# EAGLE schematic untitled (EAGLE 7.5.0)
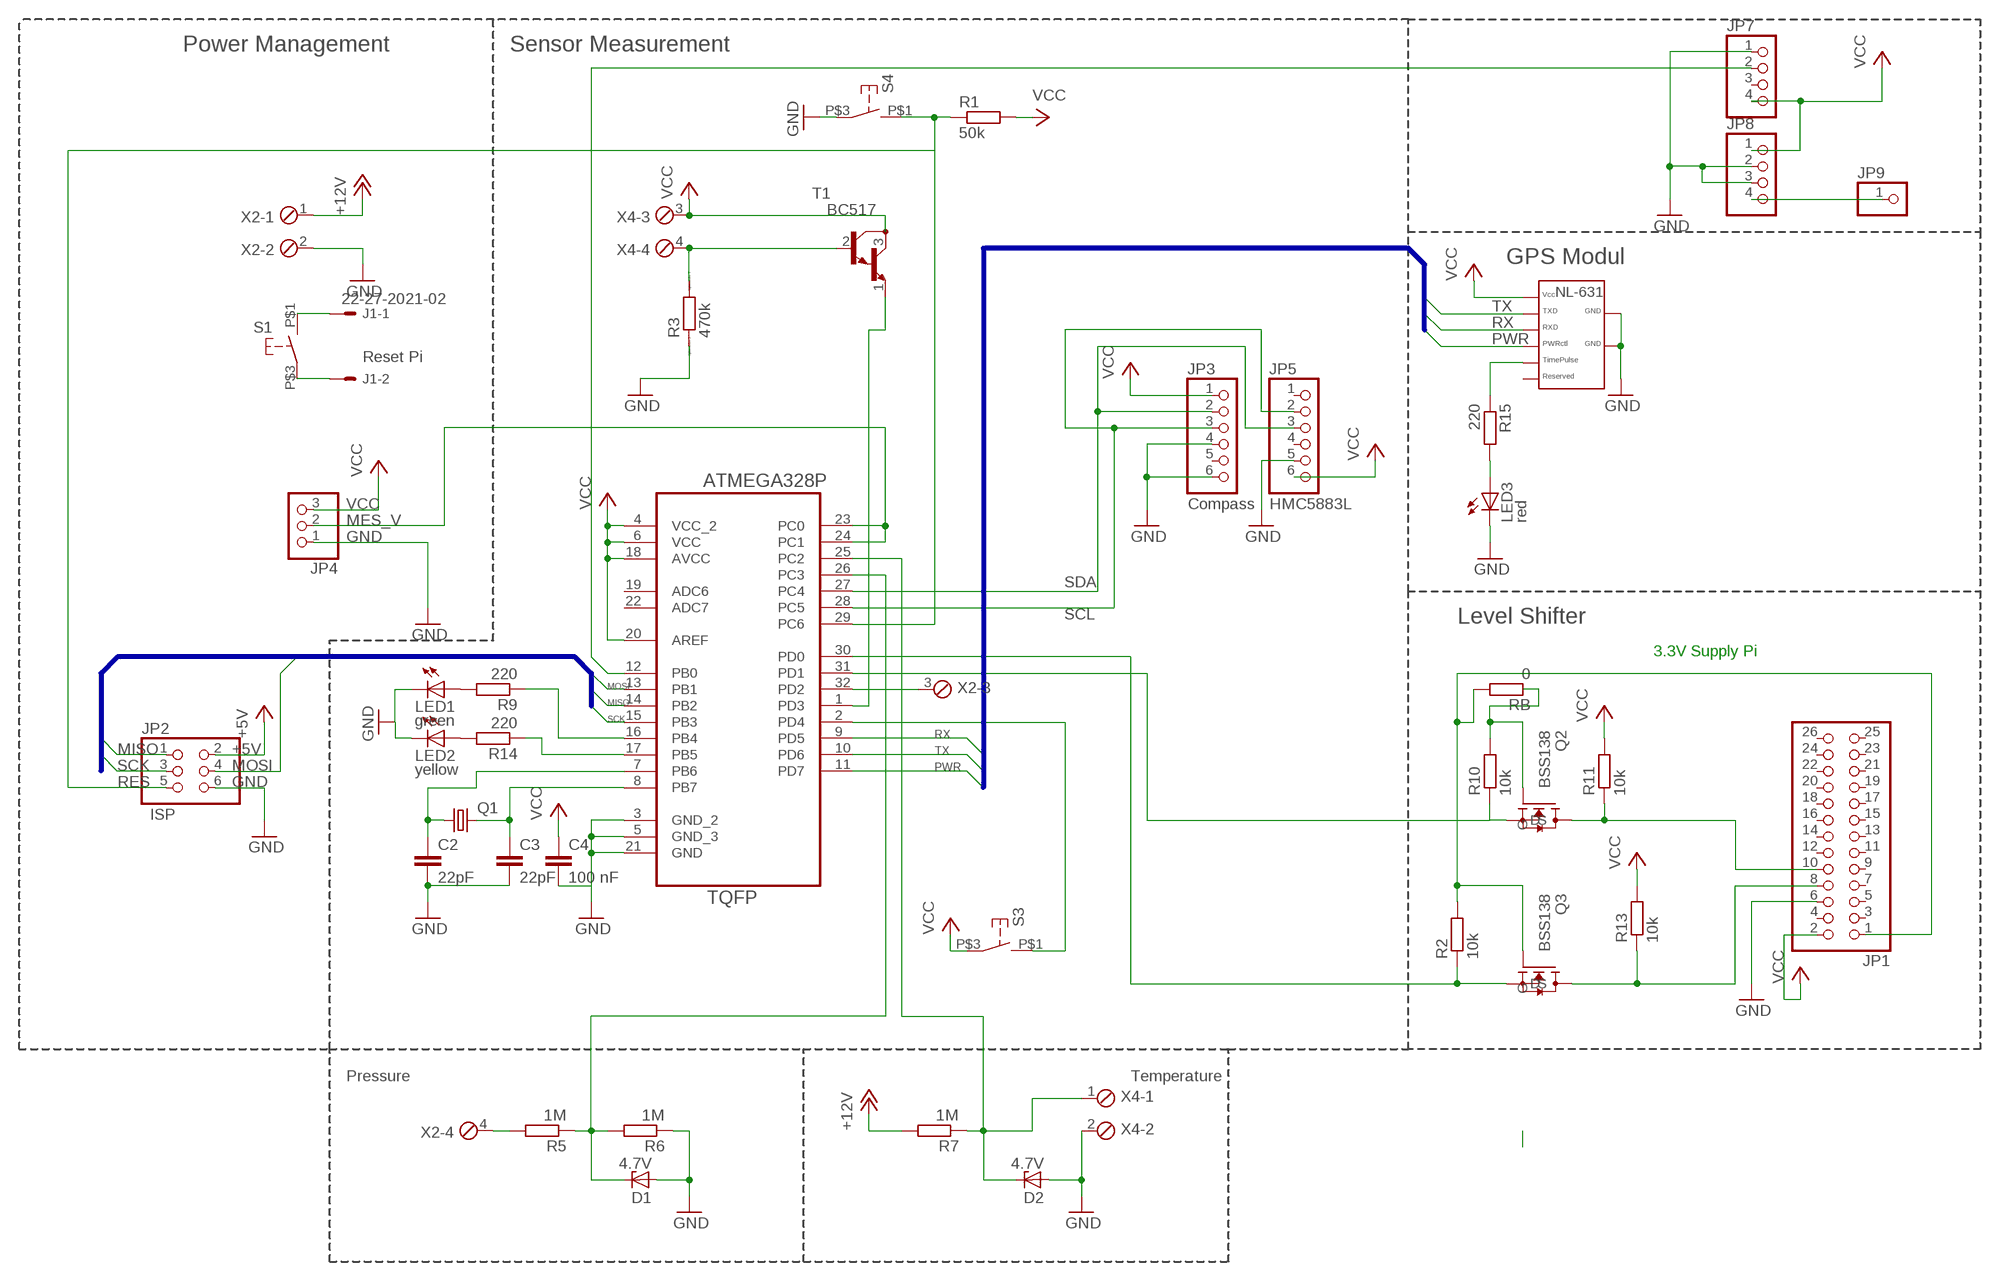
[diagram p0: schematic, sheet 1]

## Parts
C2  22pF  C-EUC1206  [C1206]
C3  22pF  C-EUC1206  [C1206]
C4  100 nF  C-EUC0603  [C0603]
D1  4.7V  ZENER-DIODESOT23  [SOT23]
D2  4.7V  ZENER-DIODESOT23  [SOT23]
IC1  ATMEGA328P-AU  [QFP80P900X900X120-32N]
J1  22-27-2021-02  [6410-02]
JP1  PINHD-2X13  [2X13]
JP2  PINHD-2X3  [2X03]
JP3  Compass  PINHD-1X6  [1X06]
JP4  PINHD-1X3  [1X03]
JP5  HMC5883L  PINHD-1X6  [1X06]
JP7  PINHD-1X4  [1X04]
JP8  PINHD-1X4  [1X04]
JP9  PINHD-1X1  [1X01]
LED1  green  LED3MM  [LED3MM]
LED2  yellow  LED3MM  [LED3MM]
LED3  red  LED3MM  [LED3MM]
Q1  CRYSTALHC49UP  [HC49UP]
Q2  BSS138  [BSS138]
Q3  BSS138  [BSS138]
R1  50k  R-EU_R1206  [R1206]
R2  10k  R-EU_R1206  [R1206]
R3  470k  RR1206  [R1206]
R5  1M  R-EU_R1206  [R1206]
R6  1M  R-EU_R1206  [R1206]
R7  1M  R-EU_R1206  [R1206]
R9  220  R-EU_R1206  [R1206]
R10  10k  R-EU_R1206  [R1206]
R11  10k  R-EU_R1206  [R1206]
R13  10k  R-EU_R1206  [R1206]
R14  220  R-EU_R1206  [R1206]
R15  220  R-EU_R1206  [R1206]
RB  0  R-EU_R1206  [R1206]
S1  SCHLIESSER_TASTSCHALTER  [NAMAE-JTP-1130]
S3  SCHLIESSER_TASTSCHALTER  [NAMAE-JTP-1130]
S4  SCHLIESSER_TASTSCHALTER  [NAMAE-JTP-1130]
T1  BC517  [TO92]
U$2  NAVILOK-NL-631ETTL  [NAVILOK-NL-631ETTL]
X2  MPT4  [4POL254]
X4  MPT4  [4POL254]

## Nets
+5V: JP2.2
+12V: R7.2 X2.1
GND: C2.2 C3.2 C4.2 D1.1(A) D2.1(A) IC1.3(GND_2) IC1.5(GND_3) IC1.21(GND) JP1.6 JP2.6 JP3.4 JP3.6 JP4.1 JP5.5 JP7.1 JP8.2 JP8.3 LED1.K(C) LED2.K(C) LED3.K(C) R3.1 R6.1 S4.P$3 U$2.P$7 U$2.P$8 X2.2 X4.2
MES_V: IC1.23(PC0) IC1.24(PC1) JP4.2
MISO: IC1.14(PB2) JP2.1
MOSI: IC1.13(PB1) JP2.4
N$1: R5.2 X2.4
N$3: C3.1 IC1.8(PB7) Q1.2
N$4: C2.1 IC1.7(PB6) Q1.1
N$5: IC1.28(PC5) JP3.3 JP5.2
N$6: R3.2 T1.2(B) X4.4
N$7: IC1.17(PB5) R14.1
N$8: JP8.4 JP9.1
N$9: IC1.32(PD2) X2.3
N$10: IC1.12(PB0) JP7.2
N$11: IC1.1(PD3) T1.1(E)
N$19: IC1.2(PD4) S3.P$1
N$20: LED1.A R9.2
N$21: IC1.27(PC4) JP3.2 JP5.3
N$23: JP1.1 Q3.G R2.2 RB.2
N$25: JP1.10 Q2.D R11.1
N$26: JP1.8 Q3.D R13.1
N$27: J1.1 S1.P$1
N$28: J1.2 S1.P$3
N$29: IC1.16(PB4) R9.1
N$30: LED2.A R14.2
N$32: R15.1 U$2.P$5
N$33: LED3.A R15.2
N$46: IC1.31(PD1) Q2.S R10.1
N$47: IC1.30(PD0) Q3.S R2.1
N$51: Q2.G R10.2 RB.1
PWR: IC1.11(PD7) U$2.P$4
RES: IC1.29(PC6) JP2.5 R1.1 S4.P$1
RESET: D1.3(C) IC1.26(PC3) R5.1 R6.2
RESET1: D2.3(C) IC1.25(PC2) R7.1 X4.1
RX: IC1.9(PD5) U$2.P$3
SCK: IC1.15(PB3) JP2.3
TX: IC1.10(PD6) U$2.P$2
VCC: C4.1 IC1.4(VCC_2) IC1.6(VCC) IC1.18(AVCC) IC1.20(AREF) JP1.2 JP3.1 JP4.3 JP5.6 JP7.4 JP8.1 R1.2 R11.2 R13.2 S3.P$3 T1.3(C) U$2.P$1 X4.3
Unconnected: IC1.19(ADC6) IC1.22(ADC7) JP1.3 JP1.4 JP1.5 JP1.7 JP1.9 JP1.11 JP1.12 JP1.13 JP1.14 JP1.15 JP1.16 JP1.17 JP1.18 JP1.19 JP1.20 JP1.21 JP1.22 JP1.23 JP1.24 JP1.25 JP1.26 JP3.5 JP5.1 JP5.4 JP7.3 U$2.P$6

## Buses
GPS:TX,RX,PWR
ISP:MOSI,MISO,SCK

## Notes on the sheet
- Power Management | Sensor Measurement
- GPS Modul
- Reset Pi
- SDA
- SCL | Level Shifter
- 3.3V Supply Pi
- ISP
- Pressure | Temperature

## Library data of the parts
C2-C4 = resistor:C-EU: CAPACITOR, European symbol
D1 D2 = diode:ZENER-DIODE: Z-Diode
IC1 = Ava:ATMEGA328P-AU; DESCRIPTION: 8-bit Microcontroller with In-System Programmable Flash; MPN: ATMEGA328P-AU; OC_FARNELL: 1715486; OC_NEWARK: 14R4631; PACKAGE: TQFP-32; SUPPLIER: Atmel
J1 = con-molex:22-?-02: CONNECTOR wire to board 2.54 mm (.1 inch) pitch header; OC_FARNELL: unknown; OC_NEWARK: unknown
JP1 = pinhead:PINHD-2X13: PIN HEADER
JP2 = pinhead:PINHD-2X3: PIN HEADER
JP3 JP5 = pinhead:PINHD-1X6: PIN HEADER
JP4 = pinhead:PINHD-1X3: PIN HEADER
JP7 JP8 = pinhead:PINHD-1X4: PIN HEADER
JP9 = pinhead:PINHD-1X1: PIN HEADER
LED1-LED3 = led:LED: LED OSRAM: - CHIPLED LG R971, LG N971, LY N971, LG Q971, LY Q971, LO R971, LY R971 LH N974, LH R974 LS Q976, LO Q976, LY Q976 LO Q996 - Hyper CHIPLED LW Q18S LB Q993, LB Q99A, LB R99A - SideLED LS A670, LO A670, LY A670, LG A670, LP A670 LB A673, LV A673, LT A673, LW A673 LH A674 LY A675 LS A676, LA A676, LO A676, LY A676, LW A676 LS A679, LY A679, LG A679 - Hyper Micro SIDELED® LS Y876, LA Y876, LO Y876, LY Y876 LT Y87S - SmartLED LW L88C, LW L88S LB L89C, LB L89S, LG L890 LS L89K, LO L89K, LY L89K LS L896, LA L896, LO L896, LY L896 - TOPLED LS T670, LO T670, LY T670, LG T670, LP T670 LSG T670, LSP T670, LSY T670, LOP T670, LYG T670 LG T671, LOG T671, LSG T671 LB T673, LV T673, LT T673, LW T673 LH T674 LS T676, LA T676, LO T676, LY T676, LB T676, LH T676, LSB T676, LW T676 LB T67C, LV T67C, LT T67C, LS T67K, LO T67K, LY T67K, LW E67C LS E67B, LA E67B, LO E67B, LY E67B, LB E67C, LV E67C, LT E67C LW T67C LS T679, LY T679, LG T679 LS T770, LO T770, LY T770, LG T770, LP T770 LB T773, LV T773, LT T773, LW T773 LH T774 LS E675, LA E675, LY E675, LS T675 LS T776, LA T776, LO T776, LY T776, LB T776 LHGB T686 LT T68C, LB T68C - Hyper Mini TOPLED® LB M676 - Mini TOPLED Santana® LG M470 LS M47K, LO M47K, LY M47K Source: http://www.osram.convergy.de LUXEON: - LUMILED® LXK2-PW12-R00, LXK2-PW12-S00, LXK2-PW14-U00, LXK2-PW14-V00 LXK2-PM12-R00, LXK2-PM12-S00, LXK2-PM14-U00 LXK2-PE12-Q00, LXK2-PE12-R00, LXK2-PE12-S00, LXK2-PE14-T00, LXK2-PE14-U00 LXK2-PB12-K00, LXK2-PB12-L00, LXK2-PB12-M00, LXK2-PB14-N00, LXK2-PB14-P00, LXK2-PB14-Q00 LXK2-PR12-L00, LXK2-PR12-M00, LXK2-PR14-Q00, LXK2-PR14-R00 LXK2-PD12-Q00, LXK2-PD12-R00, LXK2-PD12-S00 LXK2-PH12-R00, LXK2-PH12-S00 LXK2-PL12-P00, LXK2-PL12-Q00, LXK2-PL12-R00 Source: www.luxeon.com KINGBRIGHT: KA-3528ASYC Source: www.kingbright.com
Q1 = crystal:CRYSTAL: CRYSTAL; OC_FARNELL: unknown; OC_NEWARK: unknown
Q2 Q3 = Ava:BSS138: BSS138 N-Channel Logic Level Enhancement Mode Field Effect Transistor
R1 R2 R9-R11 R13-R15 RB = resistor:R-EU_: RESISTOR, European symbol
R3 = eagle-ltspice:R: RESISTOR, European symbol; SPICEMODEL: NONE; SPICEPREFIX: R
R5-R7 = rcl:R-EU_: RESISTOR, European symbol
S1 S3 S4 = 0liver:SCHLIESSER_TASTSCHALTER: Tastschalter, Schließer
T1 = transistor:BC517: NPN BIPOLAR DARLINGTON TRANSISTOR
U$2 = 0liver:NAVILOK-NL-631ETTL
X2 X4 = con-phoenix-254:MPT4: PHOENIX CONNECTOR; OC_FARNELL: unknown; OC_NEWARK: unknown